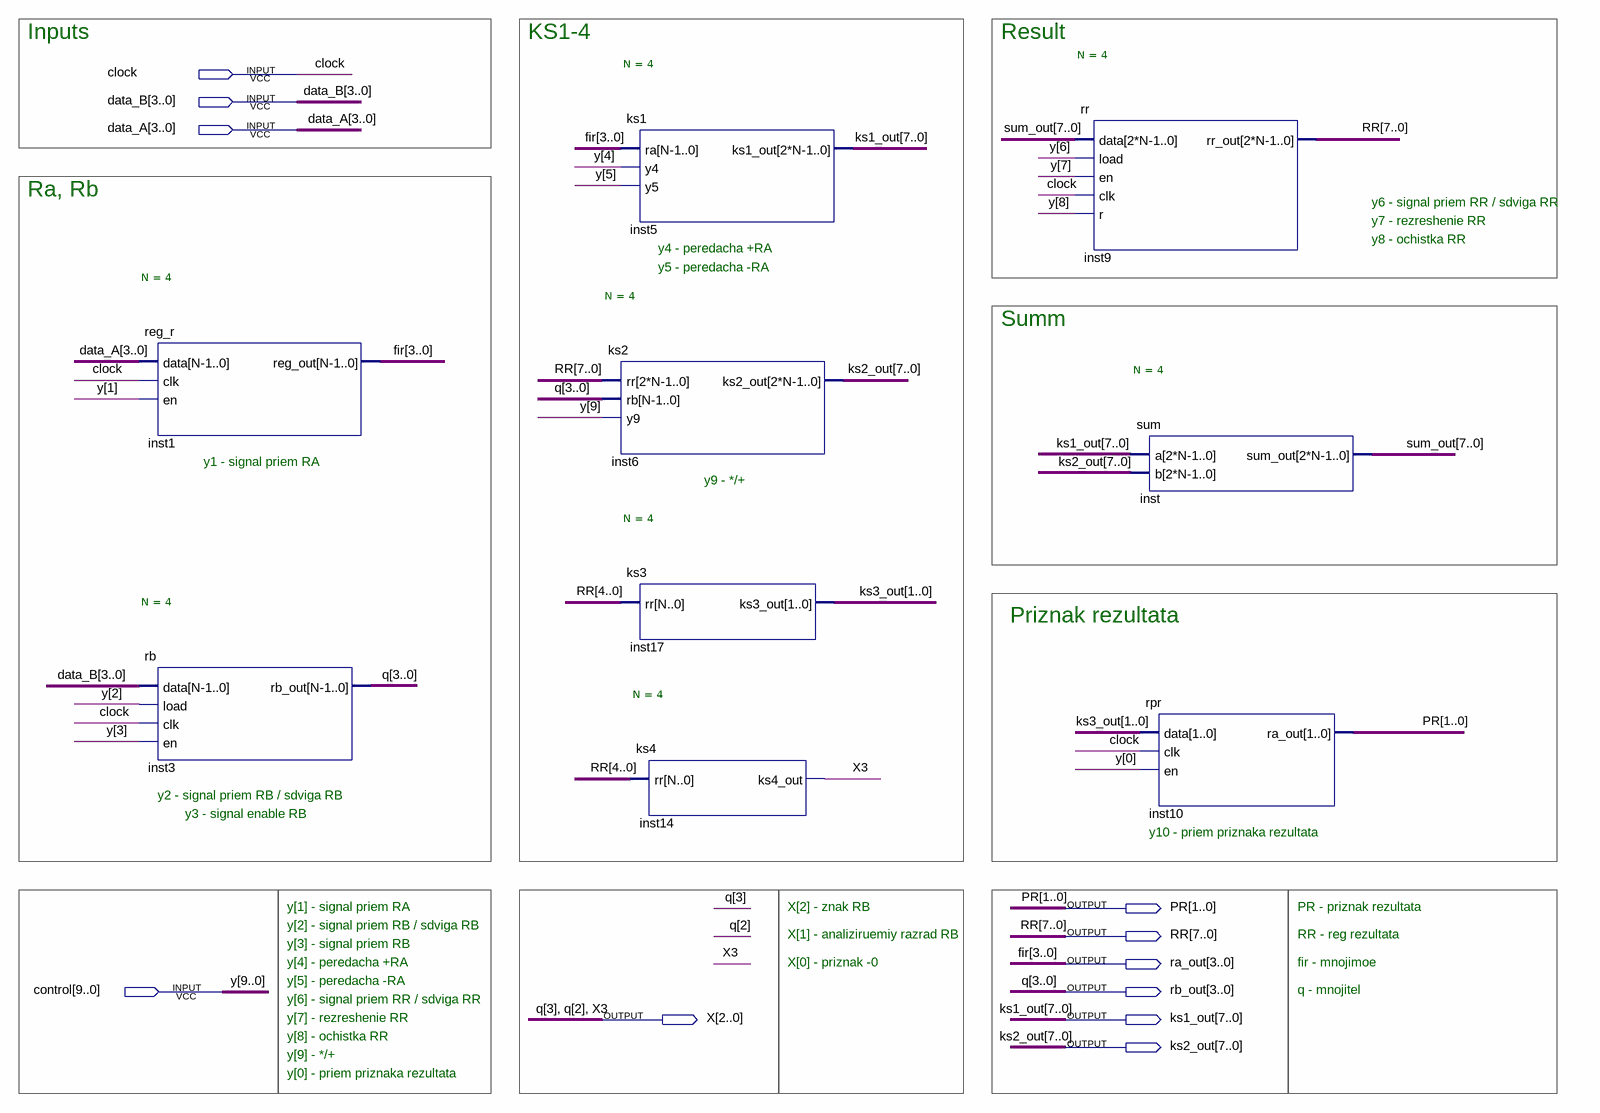
[diagram p0: schematic sheet]
// Quartus schematic bo_as_schem.bdf as structural Verilog: 9 symbols, 11 pins
module bo_as_schem (
  input  clock,
  input  [3:0] data_B,
  input  [3:0] data_A,
  input  [9:0] control,
  output [1:0] PR,
  output [7:0] RR,
  output [3:0] ra_out,
  output [3:0] rb_out,
  output [2:0] X,
  output [7:0] ks1_out,
  output [7:0] ks2_out
);

  wire [1:0] ks3_out;
  wire [7:0] sum_out;

  reg_r #(.N(4)) inst1 (.data(data_A), .clk(clock), .en(control[1]), .reg_out(ra_out));
  rb #(.N(4)) inst3 (.data(data_B), .load(control[2]), .clk(clock), .en(control[3]), .rb_out(rb_out));
  ks2 #(.N(4)) inst6 (.rr(RR), .rb(rb_out), .y9(control[9]), .ks2_out(ks2_out));
  ks1 #(.N(4)) inst5 (.ra(ra_out), .y4(control[4]), .y5(control[5]), .ks1_out(ks1_out));
  ks3 #(.N(4)) inst17 (.rr(RR[4:0]), .ks3_out(ks3_out));
  ks4 #(.N(4)) inst14 (.rr(RR[4:0]), .ks4_out(X[0]));
  rr #(.N(4)) inst9 (.data(sum_out), .load(control[6]), .en(control[7]), .clk(clock), .r(control[8]), .rr_out(RR));
  sum #(.N(4)) inst (.a(ks1_out), .b(ks2_out), .sum_out(sum_out));
  rpr inst10 (.data(ks3_out), .clk(clock), .en(control[0]), .ra_out(PR));

  assign X[2:1] = rb_out[3:2];

  // Other names for the same wires on the sheet: fir[3:0] = ra_out; q[3:0] = rb_out; X3 = X[0]; y[9:0] = control

  // Notes on the sheet:
  //   Inputs
  //   KS1-4
  //   Result
  //   Ra, Rb
  //   y6 - signal priem RR / sdviga RR
  //   y7 - rezreshenie RR
  //   y8 - ochistka RR
  //   y4 - peredacha +RA
  //   y5 - peredacha -RA
  //   Summ
  //   y1 - signal priem RA 
  //   y9 - */+
  //   Priznak rezultata
  //   y2 - signal priem RB / sdviga RB
  //   y3 - signal enable RB
  //   y10 - priem priznaka rezultata
  //   y[1] - signal priem RA 
  //   X[2] - znak RB
  //   PR - priznak rezultata
  //   y[2] - signal priem RB / sdviga RB
  //   X[1] - analiziruemiy razrad RB
  //   RR - reg rezultata
  //   y[3] - signal priem RB
  //   y[4] - peredacha +RA
  //   X[0] - priznak -0
  //   fir - mnojimoe
  //   y[5] - peredacha -RA
  //   q - mnojitel
  //   y[6] - signal priem RR / sdviga RR
  //   y[7] - rezreshenie RR
  //   y[8] - ochistka RR
  //   y[9] - */+
  //   y[0] - priem priznaka rezultata
endmodule
